# EAGLE design Orthosie (EAGLE 9.6.2)
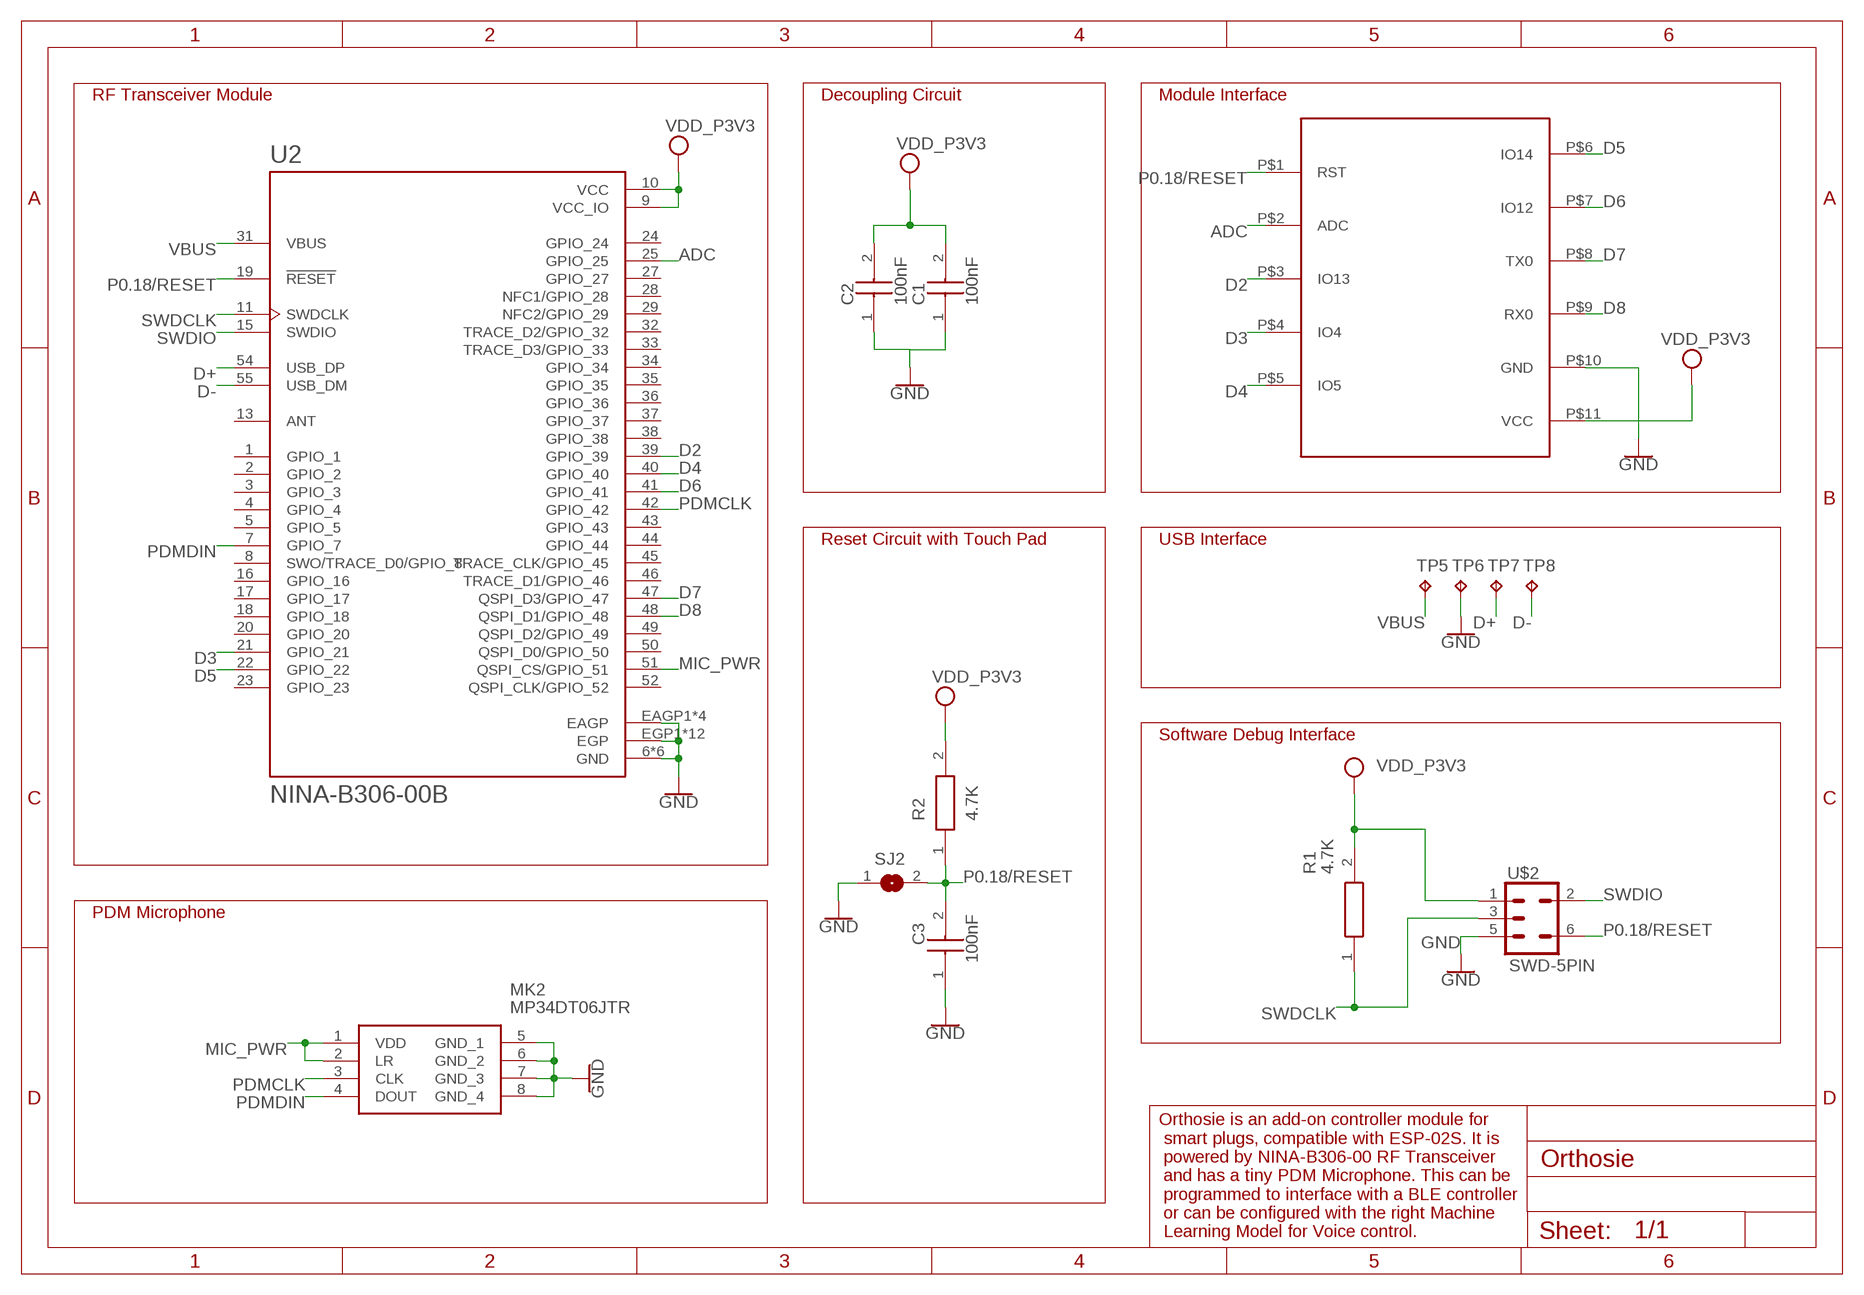
[diagram p0: schematic, sheet 1]

## Parts
C1  100nF  GJM1555C1H120JB01J  [CAPC1005X55N]
C2  100nF  GJM1555C1H120JB01J  [CAPC1005X55N]
C3  100nF  GJM1555C1H120JB01J  [CAPC1005X55N]
MK2  MP34DT06JTR  [MP34DT06JTR]
R1  4.7K  CRCW04020000Z0EE  [RESC1005X40N]
R2  4.7K  CRCW04020000Z0EE  [RESC1005X40N]
SJ2  SJ  [SJ]
TP5  TPB1,27  [B1,27]
TP6  TPB1,27  [B1,27]
TP7  TPB1,27  [B1,27]
TP8  TPB1,27  [B1,27]
U2  NINA-B306-00B  [XCVR_NINA-B306-00B]
U$1  ESP02SESP02S_MIRROR  [ESP02S_MIRROR]
U$2  SWD-5PIN  [PAD_05_03X2_TP_NO4]

## Nets
ADC: U2.25(GPIO_25) U$1.P$2(ADC)
D2: U2.39(GPIO_39) U$1.P$3(IO13)
D3: U2.21(GPIO_21) U$1.P$4(IO4)
D4: U2.40(GPIO_40) U$1.P$5(IO5)
D5: U2.22(GPIO_22) U$1.P$6(IO14)
D6: U2.41(GPIO_41) U$1.P$7(IO12)
D7: U2.47(QSPI_D3/GPIO_47) U$1.P$8(TX0)
D8: U2.48(QSPI_D1/GPIO_48) U$1.P$9(RX0)
D+: TP7.TP U2.54(USB_DP)
D-: TP8.TP U2.55(USB_DM)
GND: C1.1 C2.1 C3.1 MK2.5(GND_1) MK2.6(GND_2) MK2.7(GND_3) MK2.8(GND_4) SJ2.1 TP6.TP U2.6(GND) U2.12(GND) U2.14(GND) U2.26(GND) U2.30(GND) U2.53(GND) U2.EAGP1(EAGP) U2.EAGP2(EAGP) U2.EAGP3(EAGP) U2.EAGP4(EAGP) U2.EGP1(EGP) U2.EGP2(EGP) U2.EGP3(EGP) U2.EGP4(EGP) U2.EGP5(EGP) U2.EGP6(EGP) U2.EGP7(EGP) U2.EGP8(EGP) U2.EGP9(EGP) U2.EGP10(EGP) U2.EGP11(EGP) U2.EGP12(EGP) U$1.P$10(GND) U$2.5
MIC_PWR: MK2.1(VDD) MK2.2(LR) U2.51(QSPI_CS/GPIO_51)
P0.18/RESET: C3.2 R2.1 SJ2.2 U2.19(!RESET) U$1.P$1(RST) U$2.6
PDMCLK: MK2.3(CLK) U2.42(GPIO_42)
PDMDIN: MK2.4(DOUT) U2.7(GPIO_7)
SWDCLK: R1.1 U2.11(SWDCLK) U$2.3
SWDIO: U2.15(SWDIO) U$2.2
VBUS: TP5.TP U2.31(VBUS)
VCC: C1.2 C2.2 R1.2 R2.2 U2.9(VCC_IO) U2.10(VCC) U$1.P$11(VCC) U$2.1 ; supply symbol labelled VDD_P3V3
Unconnected: U2.1(GPIO_1) U2.2(GPIO_2) U2.3(GPIO_3) U2.4(GPIO_4) U2.5(GPIO_5) U2.8(SWO/TRACE_D0/GPIO_8) U2.13(ANT) U2.16(GPIO_16) U2.17(GPIO_17) U2.18(GPIO_18) U2.20(GPIO_20) U2.23(GPIO_23) U2.24(GPIO_24) U2.27(GPIO_27) U2.28(NFC1/GPIO_28) U2.29(NFC2/GPIO_29) U2.32(TRACE_D2/GPIO_32) U2.33(TRACE_D3/GPIO_33) U2.34(GPIO_34) U2.35(GPIO_35) U2.36(GPIO_36) U2.37(GPIO_37) U2.38(GPIO_38) U2.43(GPIO_43) U2.44(GPIO_44) U2.45(TRACE_CLK/GPIO_45) U2.46(TRACE_D1/GPIO_46) U2.49(QSPI_D2/GPIO_49) U2.50(QSPI_D0/GPIO_50) U2.52(QSPI_CLK/GPIO_52)

## Notes on the sheet
- RF Transceiver Module | Decoupling Circuit | Module Interface
- Reset Circuit with Touch Pad | USB Interface
- Software Debug Interface
- PDM Microphone
- Orthosie is an add-on controller module for
   smart plugs, compatible with ESP-02S. It is
   powered by NINA-B306-00 RF Transceiver
   and has a tiny PDM Microphone. This can be
   programmed to interface with a BLE controller
   or can be configured with the right Machine
   Learning Model for Voice control.

## Library data of the parts
C1-C3 = GJM1555C1H120JB01J-12pF0402:GJM1555C1H120JB01J: Capacitor GJM15_0.10 L=1.0mm W=0.5mm T=0.5mm Source: Datasheet <https://psearch.en.murata.com/capacitor/product/GJM1555C1H120JB01#.html>; DESCRIPTION: Capacitor GJM15_0.10 L=1.0mm W=0.5mm T=0.5mm; HEIGHT: 0.55mm; MANUFACTURER_NAME: Murata Electronics; MANUFACTURER_PART_NUMBER: GJM1555C1H120JB01J; MOUSER_PART_NUMBER: 81-GJM1555C1H120JB1J; MOUSER_PRICE-STOCK: https://www.mouser.co.uk/ProductDetail/Murata-Electronics/GJM1555C1H120JB01J?qs=563MOeNa05LNM%252BoI0iguJA%3D%3D
MK2 = MP34DT06JTR:MP34DT06JTR: 100 Hz ~ 10 kHz Digital, PDM Microphone MEMS (Silicon) Omnidirectional (-26dB +/-3dB @ 94dB SPL) Solder Pads Source: Datasheet <https://www.st.com/resource/en/datasheet/mp34dt06j.pdf>; ARROW_PART_NUMBER: MP34DT06JTR; ARROW_PRICE-STOCK: https://www.arrow.com/en/products/mp34dt06jtr/stmicroelectronics?region=nac; DESCRIPTION: 100 Hz ~ 10 kHz Digital, PDM Microphone MEMS (Silicon) Omnidirectional (-26dB +/-3dB @ 94dB SPL) Solder Pads; HEIGHT: 1.1mm; MANUFACTURER_NAME: STMicroelectronics; MANUFACTURER_PART_NUMBER: MP34DT06JTR; MOUSER_PART_NUMBER: 511-MP34DT06JTR; MOUSER_PRICE-STOCK: https://www.mouser.co.uk/ProductDetail/STMicroelectronics/MP34DT06JTR?qs=%252BEew9%252B0nqrDi3H2kv8Y1Xg%3D%3D
R1 R2 = Generic-0R-0402:CRCW04020000Z0EE: Standard Thick Film Chip Resistors value 0000 ohm. Source: Datasheet <http://www.vishay.com/docs/20035/dcrcwe3.pdf>; ARROW_PART_NUMBER: CRCW04020000Z0EE; ARROW_PRICE-STOCK: https://www.arrow.com/en/products/crcw04020000z0ee/vishay; DESCRIPTION: Standard Thick Film Chip Resistors value 0000 ohm.; HEIGHT: 0.4mm; MANUFACTURER_NAME: Vishay; MANUFACTURER_PART_NUMBER: CRCW04020000Z0EE; MOUSER_PART_NUMBER: 71-CRCW04020000Z0EE; MOUSER_PRICE-STOCK: https://www.mouser.co.uk/ProductDetail/Vishay-Dale/CRCW04020000Z0EE?qs=3qWEzBg5KnL4Q%252BFlMMG30A%3D%3D
SJ2 = jumper:SJ: SMD solder JUMPER
TP5-TP8 = testpad:TP: Test pad
U2 = NINA-B306-00B:NINA-B306-00B: With internal PCB antenna, 10.0 x 15.0 x 2.2 mm, use with open CPU Check availability <https://pricing.snapeda.com/parts/NINA-B306-00B/U-Blox/view-part?ref=eda>; AVAILABILITY: In Stock; CHECK_PRICES: https://www.snapeda.com/parts/NINA-B306-00B/u-blox/view-part/?ref=eda; DESCRIPTION: Bluetooth Bluetooth v5.0 Transceiver Module 2.4GHz Integrated, Trace Surface Mount; MF: U-Blox; MP: NINA-B306-00B; PACKAGE: SMD-55 U-Blox; PRICE: None; PURCHASE-URL: https://www.snapeda.com/api/url_track_click_mouser/?unipart_id=4800389&manufacturer=U-Blox&part_name=NINA-B306-00B&search_term=nina-b306-00b; SNAPEDA_LINK: https://www.snapeda.com/parts/NINA-B306-00B/u-blox/view-part/?ref=snap
U$1 = ESP02s:ESP02S
U$2 = SparkFun-Connectors:SWD-5PIN: 5-pin SWD connector Test-point based header for SWD. Pin 1 - PWR Pin 2 - SWDIO Pin 3 - SWCLK Pin 4 - NC Pin 5 - GND Pin 6 - RESET

## Board
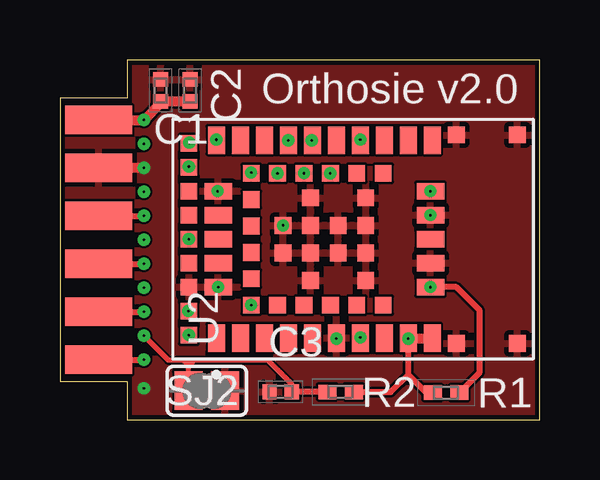
[diagram p1: board, top side]
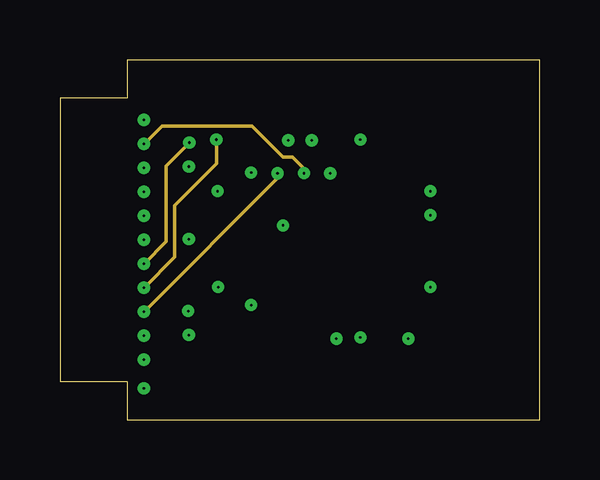
[diagram p2: board, inner layer Route2]
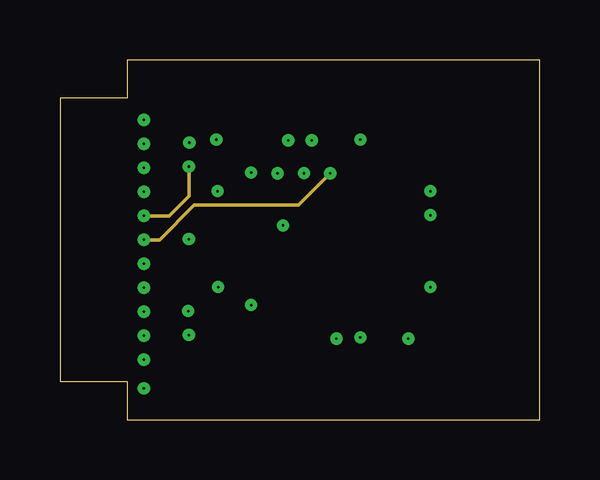
[diagram p3: board, inner layer Route3]
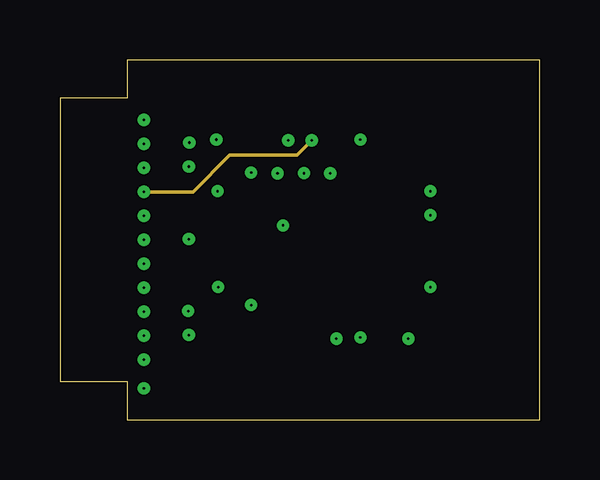
[diagram p4: board, inner layer Route14]
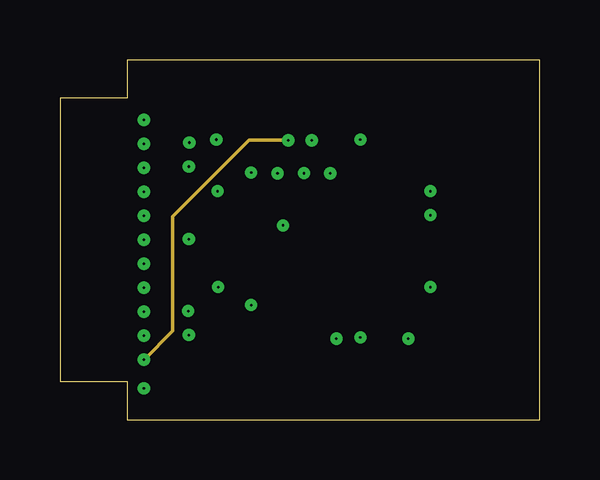
[diagram p5: board, inner layer Route15]
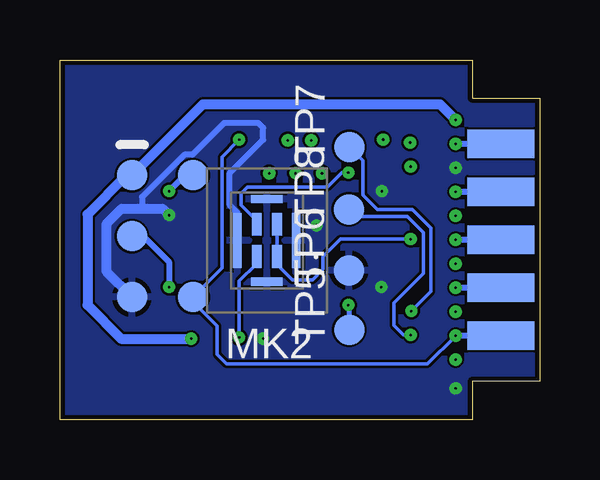
[diagram p6: board, bottom side, seen from below]

Size 20 x 15 mm. Coordinates in mm from the lower left corner, seen from the top.
Outline: 20,15 2.8,15 2.8,13.4 0,13.4 0,1.6 2.8,1.6 2.8,0 20,0 20,15
Copper layers ((1+2)*3+14*15+16): Top 0.035mm / dielectric 0.2mm / Route2 0.035mm / dielectric 1.1mm / Route3 0.035mm / dielectric 0.2mm / Route14 0.035mm / dielectric 0.15mm / Route15 0.035mm / dielectric 0.2mm / Bottom 0.035mm
Design rules "Nordic *": minimum track width 0.1mm, minimum drill 0.15mm, track to track 0.1mm, track to pad 0.1mm, pad to pad 0.1mm, via to via 0.1mm, smd to smd 0.1mm, copper to edge 0.2mm, drill to drill 0.2mm, minimum pad ring 10mil, minimum via ring 8mil, stop-mask expansion 4mil, vias tented up to drill 0mil, thermal gap 0.2mm

### Footprints (pad centres in the part's own frame; a part is rotated, then mirrored left to right if it is on the bottom)
CAPC1005X55N = smd 0.6 x 0.62: 1 -0.46,0; 2 0.46,0
MP34DT06JTR = smd 0.4 x 0.95: 1 0.425,-0.675; 2 0.425,0.675; 3 -0.425,0.675; 4 -0.425,-0.675 | smd 1.3 x 0.35: 5 0,-1.725; 7 0,1.725 | smd 0.35 x 2.3: 6 -1.225,0; 8 1.225,0
RESC1005X40N = smd 0.75 x 0.6: 1 -0.55,0; 2 0.55,0
SJ = smd 1.168 x 1.6: 1 -0.762,0; 2 0.762,0
B1,27 = smd 1.27 x 1.27: TP 0,0
XCVR_NINA-B306-00B = smd 1.15 x 0.7: 1 -4.125,5.7; 2 -4.125,4.7; 3 -4.125,3.7; 4 -4.125,2.7; 5 -4.125,1.7; 6 -4.125,0.7; 7 -4.125,-0.3; 8 -4.125,-1.3; 9 -4.125,-2.3; 10 -4.125,-3.3; 16 4.125,-3.3; 17 4.125,-2.3; 18 4.125,-1.3; 19 4.125,-0.3; 20 4.125,0.7; 21 4.125,1.7; 22 4.125,2.7; 23 4.125,3.7; 24 4.125,4.7; 25 4.125,5.7 | smd 0.7 x 1.15: 11 -2,-3.225; 12 -1,-3.225; 13 0,-3.225; 14 1,-3.225; 15 2,-3.225; 26 2,5.625; 27 1,5.625; 28 0,5.625; 29 -1,5.625; 30 -2,5.625 | smd 0.7 x 0.7: 31 -2.75,4.25; 32 -2.75,3.15; 33 -2.75,2.05; 34 -2.75,0.95; 35 -2.75,-0.15; 36 -2.75,-1.25; 37 2.75,-1.25; 38 2.75,-0.15; 39 2.75,0.95; 40 2.75,2.05; 41 2.75,3.15; 42 2.75,4.25; 43 1.65,4.25; 44 0.55,4.25; 45 -0.55,4.25; 46 -1.65,4.25; 47 4,6.85; 48 3,6.85; 49 2,6.85; 50 1,6.85; 51 0,6.85; 52 -1,6.85; 53 -2,6.85; 54 -3,6.85; 55 -4,6.85; EAGP1 -4.35,-4.3; EAGP2 4.35,-4.3; EAGP3 -4.35,-6.85; EAGP4 4.35,-6.85; EGP1 -0.575,2.925; EGP2 0.575,2.925; EGP3 -1.725,1.775; EGP4 -0.575,1.775; EGP5 0.575,1.775; EGP6 1.725,1.775; EGP7 -0.575,0.625; EGP8 0.575,0.625; EGP9 -1.725,-0.525; EGP10 -0.575,-0.525; EGP11 0.575,-0.525; EGP12 1.725,-0.525
ESP02S_MIRROR = smd 1.2 x 2.8 bottom: P$1 -3.81,0; P$2 -1.81,0; P$3 0.19,0; P$4 2.19,0; P$5 4.19,0 | smd 1.2 x 2.8: P$6 -4.81,0; P$7 -2.81,0; P$8 -0.81,0; P$9 1.19,0; P$10 3.19,0; P$11 5.19,0
PAD_05_03X2_TP_NO4 = smd 1.27 x 1.27: 1 -2.54,-1.27; 2 -2.54,1.27; 3 0,-1.27; 5 2.54,-1.27; 6 2.54,1.27

### Placement (x,y rotation side)
C1  4.2,13.72 270 top
C2  5.42,13.72 270 top
C3  9.2,1.15 0 top
MK2  11.38,7.47 0 bottom
R1  16.1,1.12 180 top
R2  11.7,1.15 0 top
SJ2  6.12,1.2 180 top
TP5  7.93,3.75 90 bottom
TP6  7.96,6.22 90 bottom
TP7  7.93,11.37 90 bottom
TP8  7.96,8.77 90 bottom
U2  12.22,7.53 90 top
U$1  1.61,7.31 90 top
U$2  15.72,7.65 270 bottom

### Tracks (layer width: path | path; a pad name or v marks a point on that pad's centre or on a via)
ADC  (via drill 0.1, 0.11)
  Top 0.254: U2.25 v6.53,11.68
  Route2 0.152: v6.53,11.68 6.53,10.68 4.78,8.93 4.78,6.78 v3.5,5.5
  Bottom 0.254: U$1.P$2 v3.5,5.5
D2  (via drill 0.1, 0.11)
  Route3 0.152: v3.5,7.5 4.15,7.5 5.6,8.95 9.95,8.95 U2.39
  Bottom 0.254: U$1.P$3 v3.5,7.5
  other vias: 11.28,10.28
D3  (via drill 0.1, 0.11)
  Top 0.254: U2.21 v10.5,11.65
  Route14 0.152: v3.5,9.5 5.55,9.5 7.08,11.03 9.88,11.03 v10.5,11.65
  Bottom 0.254: U$1.P$4 v3.5,9.5
D4  (via drill 0.1)
  Route2 0.152: v3.5,11.5 4.25,12.25 8,12.25 9.3,10.95 9.7,10.95 10.18,10.47 U2.40
  Bottom 0.254: U$1.P$5 v3.5,11.5
  other vias: 10.18,10.28
D5  (via drill 0.1, 0.11)
  Top 0.254: U$1.P$6 v3.5,2.5
  Route15 0.152: v9.53,11.65 7.88,11.65 4.7,8.47 4.7,3.7 v3.5,2.5
D6  (via drill 0.1, 0.11)
  Top 0.254: U$1.P$7 v3.5,4.5
  Route2 0.152: v3.5,4.5 9.07,10.07 U2.41
  other vias: 9.07,10.28
D7  (via drill 0.1, 0.11)
  Top 0.254: U2.47 v5.4,11.55 | U$1.P$8 v3.5,6.5
  Route2 0.152: v5.4,11.55 4.42,10.57 4.42,7.42 v3.5,6.5
D8  (via drill 0.1, 0.11)
  Top 0.254: U2.48 v5.38,10.55 | U$1.P$9 v3.5,8.5
  Route3 0.152: v3.5,8.5 4.55,8.5 5.38,9.32 v5.38,10.55
D+  (via drill 0.1)
  Top 0.254: U2.54 v5.35,4.53
  Bottom 0.152: v5.35,4.53 4.53,5.35 4.53,7.99 5.3,8.77 6.75,8.77 7.36,9.37 7.36,10.79 TP7.TP
D-  (via drill 0.1)
  Bottom 0.152: TP8.TP 7.66,8.47 5.52,8.47 4.85,7.8 4.85,6.1 6.08,4.88 6.08,3.92 5.67,3.52 v5.38,3.52
GND  (via drill 0.1)
  Top 0.254: U2.26 v6.58,9.53
  Top 0.406: v3.5,10.5 U$1.P$10
  Bottom 0.254: MK2.6 12.6,8.62 12.93,8.95 12.93,10.28 11.53,11.68 11.53,12.18 11.72,12.38 13.15,12.38 14.47,11.05 14.81,11.05 16.57,9.29 16.57,8.8
  Bottom 0.406: U$2.5 18.05,6.17 18.05,8.18 17.43,8.8 16.57,8.8 15.72,8.8 U2.14
  other vias: 6.6,5.53 9.3,8.1 15.45,8.53 11.53,3.38 3.5,1.3
  pour Top: 20,0 2.8,0 2.8,1.6 0,1.6 0,13.41 2.79,13.41 2.8,13.4 2.8,15 20,15
  pour Bottom: 20,0 2.8,0 2.8,1.6 0,1.6 0,13.4 2.8,13.4 2.8,15 20,15
MIC_PWR  (via drill 0.1)
  Bottom 0.152: MK2.2 MK2.1 10.95,6.47 10.3,5.83 9.47,5.83 9.03,6.28 9.03,6.8 8.3,7.53 U2.51
  other vias: 5.38,7.53
P0.18/RESET  (via drill 0.1)
  Top 0.203: C3.2 9.66,1.49 8.68,2.48 5.6,2.48 | v3.5,3.5 4.53,2.48 5.15,2.48 | 5.6,2.48 5.38,2.48 | 5.38,2.48 5.15,2.48 | SJ2.2 5.36,2.26 | 5.36,2.26 5.36,2.46 5.38,2.48 | 5.15,2.48 5.36,2.26 | 5.36,2.26 5.39,2.26 5.6,2.48
  Top 0.254: R2.1 C3.2 | U2.19 v12.53,11.68
  Bottom 0.152: v12.53,11.68 13.25,10.95 13.25,6.32 U$2.6 14.46,4.91 13.45,3.9 13.45,2.73 13.05,2.33 4.67,2.33 v3.5,3.5
  Bottom 0.254: U$1.P$1 v3.5,3.5
PDMCLK  (via drill 0.1)
  Top 0.254: U2.42 v7.97,10.3
  Bottom 0.152: v7.97,10.3 8.25,10.3 8.85,9.7 12.18,9.7 12.45,9.43 12.45,8.95 11.8,8.3 MK2.3
PDMDIN  (via drill 0.1)
  Top 0.254: U2.7 v12.53,3.42
  Bottom 0.152: v12.53,3.42 12.53,5.78 11.8,6.5 MK2.4
SWDCLK  (via drill 0.1)
  Top 0.254: R1.1 17.5,1.98 17.5,4.55 16.52,5.53 U2.11
  Bottom 0.254: U2.11 15.45,6.58 16.52,7.65 U$2.3
  other vias: 15.45,5.53
SWDIO  (via drill 0.1)
  Bottom 0.254: U$2.2 14.79,10.19 U2.15
  other vias: 15.45,9.53
VBUS  (via drill 0.1)
  Bottom 0.152: 7.93,4.73 U2.31
  Bottom 0.203: TP5.TP 7.93,4.73
  other vias: 7.97,4.78
VCC  (via drill 0.1)
  Top 0.254: R1.2 15.28,1.12 14.53,1.88 | 14.53,1.88 v14.53,3.38 U2.9 | R2.2 13.8,1.15 14.53,1.88
  Top 0.406: U2.10 15.5,3.38 v14.53,3.38 | C2.2 C1.2 4.2,13.2 v3.5,12.5 U$1.P$11
  Bottom 0.406: v3.5,12.5 4.15,13.15 14.04,13.15 U$2.1 17.22,10.19 18.85,8.56 18.85,4.78 17.45,3.38 v14.53,3.38

### Text on the board
tNames: Orthosie v2.0